# EAGLE design WobblebotBP (EAGLE 9.5.1)
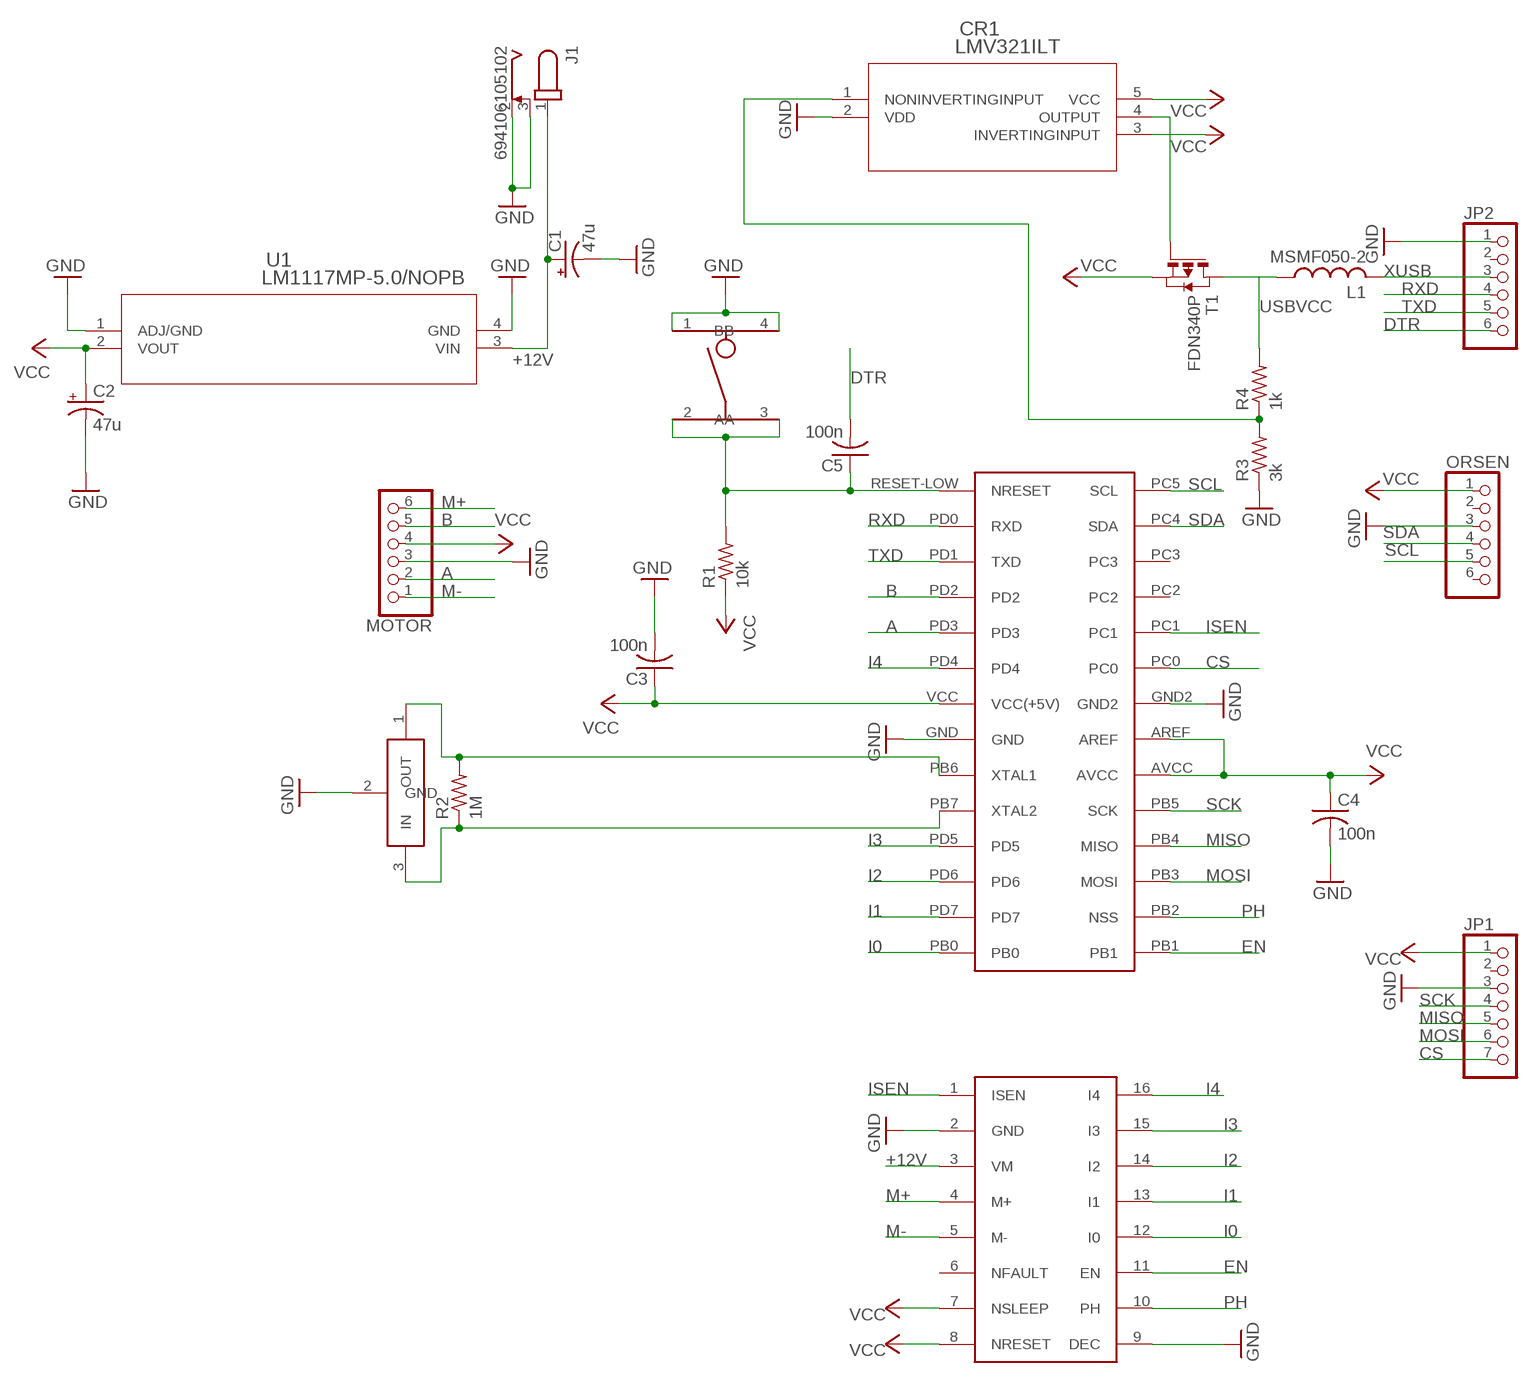
[diagram p0: schematic, sheet 1]

## Parts
C1  47u  CPOL-US153CLV-0605  [153CLV-0605]
C2  47u  CPOL-US153CLV-0605  [153CLV-0605]
C3  100n  C-USC0805  [C0805]
C4  100n  C-USC0805  [C0805]
C5  100n  C-USC0805  [C0805]
CR1  LMV321ILT  [SOT23-5]
J1  694106105102  [694106105102]
JP1  PINHD-1X7  [1X07]
JP2  PINHD-1X6  [1X06]
L1  MSMF050-2  L-USL1812  [L1812]
MOTOR  PINHD-1X6  [1X06]
ORSEN  PINHD-1X6  [1X06]
R1  10k  R-US_R0805  [R0805]
R2  1M  R-US_R0805  [R0805]
R3  3k  R-US_R0805  [R0805]
R4  1k  R-US_R0805  [R0805]
T1  FDN340P  PMOSSOT23  [SOT-23]
U1  LM1117MP-5.0/NOPB  [MP04A]
U$1  AT328P-DIP-SOCKET  [AT328P-BASIC-BOARD1]
U$2  PUSHBUTTON  EVQ-Q2Y03WPUSHBUTTON  [DFN660X600X40-4N]
U$3  CSTNE16M0V53C000R0  [CSTNE16M0V53C000R0]
U$4  MTRDRVRMTRDRVR  [HDRVR16W64P2784X254_2X8_2100X3000X254B]

## Nets
+12V: C1.+ J1.1 U1.3(VIN) U$4.3(VM)
A: MOTOR.2 U$1.PD3
B: MOTOR.5 U$1.PD2
CS: JP1.7 U$1.PC0
DTR: C5.2 JP2.6
EN: U$1.PB1 U$4.11(EN)
GND: C1.- C2.- C3.2 C4.2 CR1.2(VDD) J1.2 J1.3 JP1.3 JP2.1 MOTOR.3 ORSEN.3 R3.1 U1.1(ADJ/GND) U1.4(GND) U$1.GND U$1.GND2 U$2.1(B) U$2.4(B') U$3.2(GND) U$4.2(GND) U$4.9(DEC)
I0: U$1.PB0 U$4.12(I0)
I1: U$1.PD7 U$4.13(I1)
I2: U$1.PD6 U$4.14(I2)
I3: U$1.PD5 U$4.15(I3)
I4: U$1.PD4 U$4.16(I4)
ISEN: U$1.PC1 U$4.1(ISEN)
M+: MOTOR.6 U$4.4(M+)
M-: MOTOR.1 U$4.5(M-)
MISO: JP1.5 U$1.PB4(MISO)
MOSI: JP1.6 U$1.PB3(MOSI)
N$1: R2.2 U$1.PB6(XTAL1) U$3.1(OUT)
N$2: R2.1 U$1.PB7(XTAL2) U$3.3(IN)
N$4: C4.1 U$1.AREF U$1.AVCC ; supply symbol labelled VCC
N$5: CR1.1(NONINVERTINGINPUT) R3.2 R4.1
N$6: CR1.4(OUTPUT) T1.3(G)
PH: U$1.PB2(NSS) U$4.10(PH)
RESET: C5.1 R1.2 U$1.RESET-LOW(NRESET) U$2.2(A) U$2.3(A')
RXD: JP2.4 U$1.PD0(RXD)
SCK: JP1.4 U$1.PB5(SCK)
SCL: ORSEN.5 U$1.PC5(SCL)
SDA: ORSEN.4 U$1.PC4(SDA)
TXD: JP2.5 U$1.PD1(TXD)
USBVCC: L1.1 R4.2 T1.1(D)
VCC: C2.+ C3.1 CR1.3(INVERTINGINPUT) CR1.5(VCC) JP1.1 MOTOR.4 ORSEN.1 R1.1 T1.2(S) U1.2(VOUT) U$1.VCC(VCC(+5V)) U$4.7(NSLEEP) U$4.8(NRESET)
XUSB: JP2.3 L1.2
Unconnected: JP1.2 JP2.2 ORSEN.2 ORSEN.6 U$1.PC2 U$1.PC3 U$4.6(NFAULT)

## Library data of the parts
C1 C2 = rcl:CPOL-US: POLARIZED CAPACITOR, American symbol; SPICEPREFIX: C
C3-C5 = rcl:C-US: CAPACITOR, American symbol; SPICEPREFIX: C
CR1 = wobbleBot:LMV321ILT; MANUFACTURER_PART_NUMBER: LMV321ILT; VENDOR: STMicroelectronics
J1 = DC Power Jacks:694106105102: CONN PWR JACK 2.05X5.5MM SOLDER Manufacturer's datasheet <https://katalog.we-online.de/em/datasheet/6941xx105102.pdf>; CREATED_BY: PCBLayout.com; DIGIKEY_PART_NUMBER: 732-5928-2-ND; MANUFACTURER: Wurth Electronics Inc.; MPN: 694106105102
JP1 = pinhead:PINHD-1X7: PIN HEADER
JP2 MOTOR ORSEN = pinhead:PINHD-1X6: PIN HEADER
L1 = rcl:L-US: INDUCTOR, American symbol; SPICEPREFIX: L
R1-R4 = rcl:R-US_: RESISTOR, American symbol; SPICEPREFIX: R
T1 = zetex:PMOSSOT23: MOS FET; OC_FARNELL: unknown; OC_NEWARK: unknown
U1 = wobbleBot:LM1117MP-5.0/NOPB; MANUFACTURER_PART_NUMBER: LM1117MP5.0NOPB; VENDOR: Texas Instruments
U$1 = AT328p-dip-socket:AT328P-DIP-SOCKET
U$2 = wobbleBot:EVQ-Q2Y03W: Panasonic pushbutton tactile switch
U$3 = wobbleBot:CSTNE16M0V53C000R0
U$4 = wobbleBot:MTRDRVR

## Board
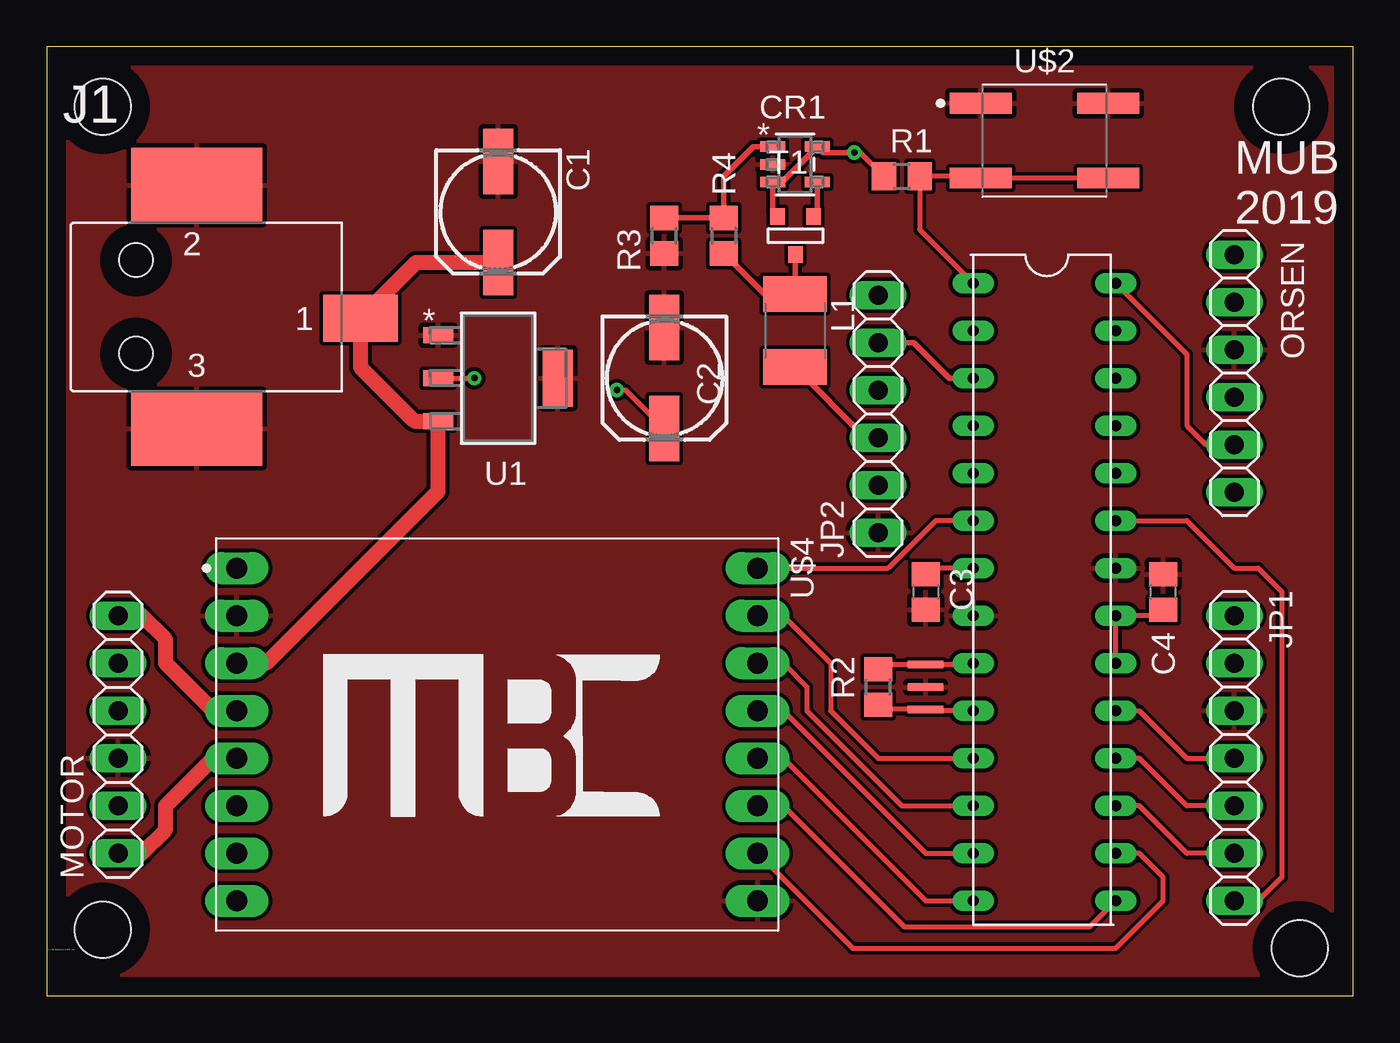
[diagram p1: board, top side]
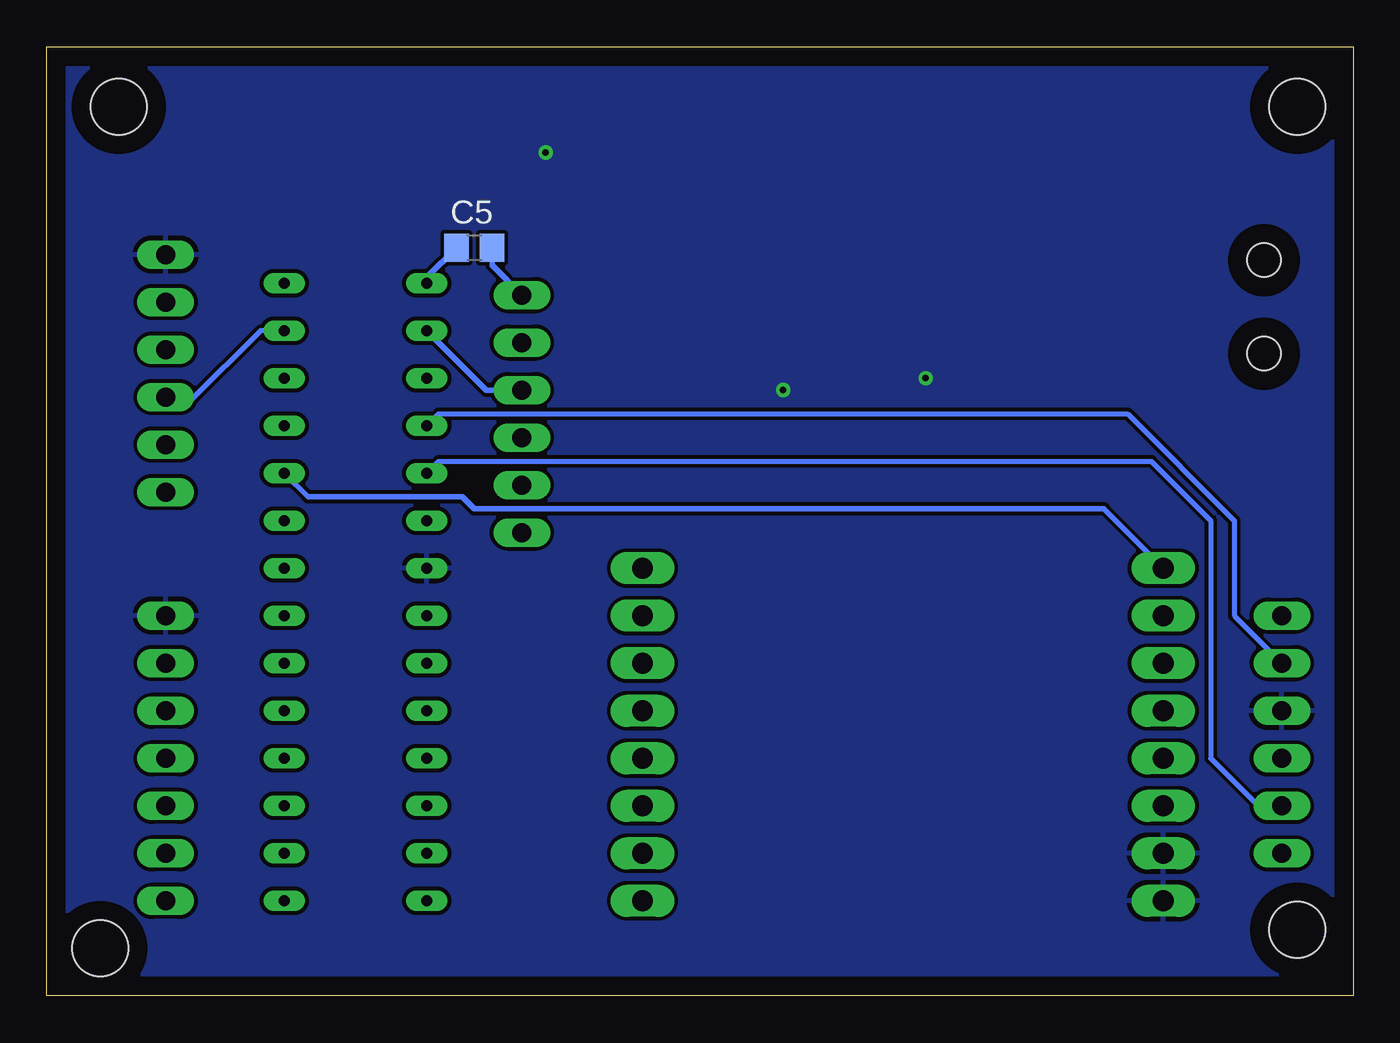
[diagram p2: board, bottom side, seen from below]

Size 69.85 x 50.74 mm. Coordinates in mm from the lower left corner, seen from the top.
Outline: 0,0 69.85,0 69.85,50.74 0,50.74 0,0
Copper layers (1*16): Top 0.035mm / dielectric 1.5mm / Bottom 0.035mm
Design rules "PCBway": minimum track width 6mil, minimum drill 0.3mm, track to track 0.205mm, track to pad 0.205mm, pad to pad 0.205mm, via to via 0.205mm, smd to smd 8mil, copper to edge 40mil, drill to drill 8mil, minimum pad ring 10mil, minimum via ring 8mil, stop-mask expansion 4mil, vias tented up to drill 25mil, thermal gap 10mil
Holes 3 mm at 3,3.54 3,47.54 67,2.54 66,47.54

### Footprints (pad centres in the part's own frame; a part is rotated, then mirrored left to right if it is on the bottom)
153CLV-0605 = smd 3.5 x 1.6: + 2.7,0; - -2.7,0
C0805 = smd 1.3 x 1.5: 1 -0.95,0; 2 0.95,0
SOT23-5 = smd 1.321 x 0.559: 1 -1.194,0.95; 2 -1.194,0; 3 -1.194,-0.95; 4 1.194,-0.95; 5 1.194,0.95
694106105102 = smd 4 x 2.5: 1 15.5,-0.6 | smd 7 x 4: 2 6.75,6.5; 3 6.75,-6.5 | hole 1.8: 3.5,2.5; 3.5,-2.5
1X07 = drill 1.016 long: 1 -7.62,0; 2 -5.08,0; 3 -2.54,0; 4 0,0; 5 2.54,0; 6 5.08,0; 7 7.62,0
1X06 = drill 1.016 long: 1 -6.35,0; 2 -3.81,0; 3 -1.27,0; 4 1.27,0; 5 3.81,0; 6 6.35,0
L1812 = smd 1.9 x 3.4: 1 -1.95,0; 2 1.95,0
R0805 = smd 1.3 x 1.5: 1 -0.95,0; 2 0.95,0
SOT-23 = smd 0.787 x 0.889: 1 0.025,-1.016; 2 -0.94,1.016; 3 0.991,1.016
MP04A = smd 1.6 x 0.838: 1 -3.2,2.3; 2 -3.2,0; 3 -3.2,-2.3 | smd 1.6 x 3.048: 4 3.2,0
AT328P-BASIC-BOARD1 = drill 0.6 long: AREF 15.24,0; AVCC 12.7,0; GND 15.24,7.62; GND2 17.78,0; PB0 0,7.62; PB1 0,0; PB2 2.54,0; PB3 5.08,0; PB4 7.62,0; PB5 10.16,0; PB6 12.7,7.62; PB7 10.16,7.62; PC0 20.32,0; PC1 22.86,0; PC2 25.4,0; PC3 27.94,0; PC4 30.48,0; PC5 33.02,0; PD0 30.48,7.62; PD1 27.94,7.62; PD2 25.4,7.62; PD3 22.86,7.62; PD4 20.32,7.62; PD5 7.62,7.62; PD6 5.08,7.62; PD7 2.54,7.62; RESET-LOW 33.02,7.62; VCC 17.78,7.62
DFN660X600X40-4N = smd 3.312 x 1.112: 1 -3.4,2; 2 -3.4,-2; 3 3.4,-2; 4 3.4,2
CSTNE16M0V53C000R0 = smd 0.4 x 1.9: 1 -1.2,0; 2 0,0; 3 1.2,0
HDRVR16W64P2784X254_2X8_2100X3000X254B = drill 1.105 pad 1.705 long: 1 0,0; 2 2.54,0; 3 5.08,0; 4 7.62,0; 5 10.16,0; 6 12.7,0; 7 15.24,0; 8 17.78,0; 9 17.78,27.84; 10 15.24,27.84; 11 12.7,27.84; 12 10.16,27.84; 13 7.62,27.84; 14 5.08,27.84; 15 2.54,27.84; 16 0,27.84

### Placement (x,y rotation side)
C1  24.13,41.91 270 top
C2  33.02,33.02 270 top
C3  46.99,21.59 270 top
C4  59.69,21.59 90 top
C5  46.99,40.01 0 bottom
CR1  40.01,44.45 0 top
J1  1.27,36.83 0 top
JP1  63.5,12.7 270 top
JP2  44.45,31.11 90 top
L1  40.01,35.56 270 top
MOTOR  3.81,13.97 90 top
ORSEN  63.5,33.27 270 top
R1  45.72,43.81 0 top
R2  44.45,16.51 90 top
R3  33.02,40.64 90 top
R4  36.2,40.64 270 top
T1  40.01,40.64 0 top
U1  24.13,33.02 0 top
U$1  57.15,5.08 90 top
U$2  53.34,45.72 0 top
U$3  46.99,16.51 270 top
U$4  10.16,22.86 270 top

### Tracks (layer width: path | path; a pad name or v marks a point on that pad's centre or on a via)
+12V
  Top 0.813: U$4.3 11.74,17.78 20.93,26.97 U1.3 19.66,30.72 16.77,33.61 J1.1 19.75,39.21 C1.+
A
  Bottom 0.254: U$1.PD3 48.9,28.57 10.79,28.57 7.62,25.4 7.62,12.7 5.08,10.16 MOTOR.2
B
  Bottom 0.254: MOTOR.5 6.35,20.32 6.35,25.4 12.06,31.11 48.9,31.11 U$1.PD2
CS
  Top 0.254: U$1.PC0 60.96,25.4 63.5,22.86 64.77,22.86 66.04,21.59 66.04,6.35 64.77,5.08 JP1.7
DTR
  Bottom 0.305: C5.2 46.04,39.05 JP2.6
EN
  Top 0.254: U$4.11 39.37,10.16 45.85,3.68 55.75,3.68 U$1.PB1
GND
  pour Top: 0,50.8 69.85,50.8 69.85,0 0,0
I0
  Top 0.254: U$4.12 39.37,12.7 46.99,5.08 U$1.PB0
I1
  Top 0.254: U$4.13 39.37,15.24 46.99,7.62 U$1.PD7
I2
  Top 0.254: U$4.14 39.37,17.78 40.64,16.51 40.64,15.24 45.72,10.16 U$1.PD6
I3
  Top 0.254: U$4.15 39.37,20.32 41.91,17.78 41.91,15.24 44.45,12.7 U$1.PD5
I4
  Top 0.254: U$4.16 44.98,22.86 47.52,25.4 U$1.PD4
ISEN
  Bottom 0.254: U$4.1 13.34,26.04 | U$1.PC1 55.88,26.67
  Bottom 0.305: 55.88,26.67 47.62,26.67 46.99,26.04 13.34,26.04
M+
  Top 0.813: U$4.4 8.89,15.24 6.35,17.78 6.35,19.05 5.08,20.32 MOTOR.6
M-
  Top 0.813: MOTOR.1 5.08,7.62 6.35,8.89 6.35,10.16 8.89,12.7 U$4.5
MISO
  Top 0.254: JP1.5 60.96,10.16 58.42,12.7 U$1.PB4
MOSI
  Top 0.254: JP1.6 60.96,7.62 58.42,10.16 U$1.PB3
N$1
  Top 0.254: U$1.PB6 49.46,17.71 U$3.1 44.7,17.71 R2.2
N$2
  Top 0.254: U$1.PB7 47.06,15.24 U$3.3 44.7,15.31 R2.1
N$4
  Top 0.254: C4.1 59.37,20.32 U$1.AREF U$1.AVCC
N$5
  Top 0.305: R3.2 R4.1 36.2,43.81 37.78,45.4 CR1.1
N$6
  Top 0.305: CR1.4 41.2,41.86 T1.3
PH
  Top 0.254: U$4.10 43.08,2.54 57.15,2.54 59.69,5.08 59.69,6.35 58.42,7.62 U$1.PB2
RESET
  Top 0.254: U$1.RESET-LOW 46.67,40.96 R1.2 49.84,43.81 U$2.2 U$2.3
  Bottom 0.305: C5.1 49.53,38.41 U$1.RESET-LOW
RXD
  Bottom 0.305: U$1.PD0 46.35,32.38 JP2.4
SCK
  Top 0.254: U$1.PB5 58.42,15.24 60.96,12.7 JP1.4
SCL
  Top 0.254: U$1.PC5 60.96,34.29 60.96,30.48 61.98,29.46 ORSEN.5
SDA
  Bottom 0.254: U$1.PC4 58.42,35.56 62.23,31.75 63.25,31.75 ORSEN.4
TXD
  Top 0.305: U$1.PD1 48.26,33.02 46.35,34.92 JP2.5
USBVCC
  Top 0.305: T1.1 40.01,39.6 L1.1 38.38,37.51 R4.2
VCC  (via drill 0.35)
  Top 0.254: U$1.VCC 47.31,22.86 C3.1 | U1.2 v22.86,33.02 | C2.+ 30.95,32.38 v30.48,32.38
  Top 0.305: T1.2 38.81,41.91 CR1.3 39.31,43.5 39.83,44.02 39.83,44.03 CR1.5 41.51,45.09 v43.18,45.09 43.5,45.09 R1.1
  pour Bottom: 0,50.8 69.85,50.8 69.85,0 0,0
XUSB
  Top 0.305: JP2.3 43.77,29.84 L1.2

### Text on the board
tPlace: MUB / 2019 | /Users/MoBo/Downloads/MBC.bmp